# EAGLE design tick-box-1591A-mk-2.0 (EAGLE 6.5.0)
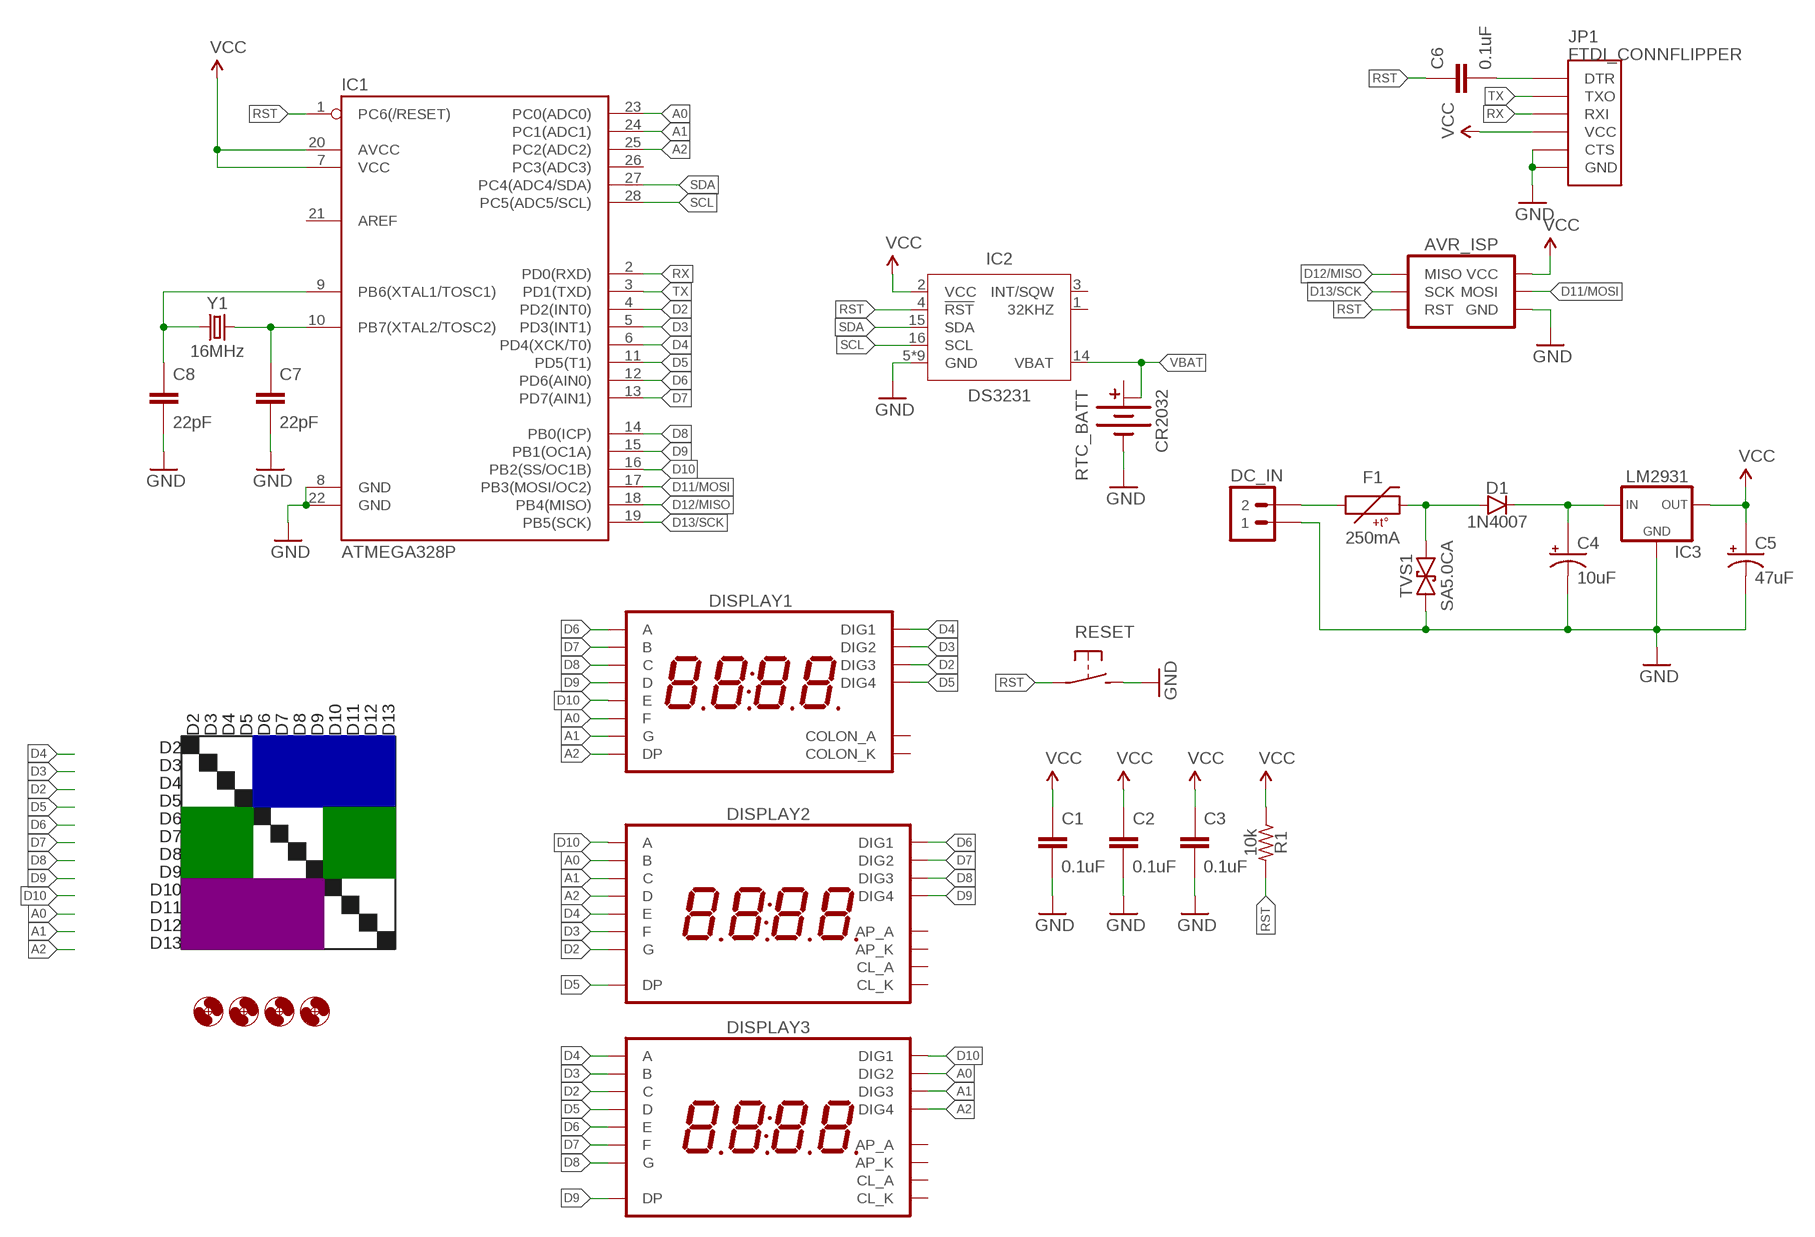
[diagram p0: schematic, sheet 1]

## Parts
AVR_ISP  AVR_SPI_PRG_6PTH  [2X3]
C1  0.1uF  CAPACITOR-CERAMIC025-024X044  [C025-024X044]
C2  0.1uF  CAPACITOR-CERAMIC025-024X044  [C025-024X044]
C3  0.1uF  CAPACITOR-CERAMIC025-024X044  [C025-024X044]
C4  10uF  CAPACITOR-POLARIZEDE2-4  [E2-4]
C5  47uF  CAPACITOR-POLARIZEDE2-4  [E2-4]
C6  0.1uF  CAPACITOR-CERAMIC025-024X044  [C025-024X044]
C7  22pF  CAPACITOR-CERAMIC025-024X044  [C025-024X044]
C8  22pF  CAPACITOR-CERAMIC025-024X044  [C025-024X044]
D1  1N4007  DIODEPTH-10.68MM  [DIODE-10.16MM]
DC_IN  M02PTH  [1X02]
DISPLAY1  7SEG_4DIGIT_COLON14.2MM-CC-NS  [7SEG_4DIG_NS]
DISPLAY2  7SEG_4DIGIT_COLON_APOS  [7SEG_4DIG_10MM]
DISPLAY3  7SEG_4DIGIT_COLON_APOS  [7SEG_4DIG_10MM]
F1  250mA  PTCSMD  [PTC-1206]
H1  HOLE#2  [HOLE-#2]
H2  HOLE#2  [HOLE-#2]
H3  HOLE#2  [HOLE-#2]
H4  HOLE#2  [HOLE-#2]
IC1  ATMEGA328P  ATMEGA328P_PDIP  [DIL28-3]
IC2  DS3231  [SO16W]
IC3  LM2931  V_REG_78XXTO-92-INLINE  [TO-92-AMMO]
JP1  FTDI_CONNFLIPPER  [FTDI_CONN_FLIP]
R1  10k  RESISTORPTH-AXIAL-6.35MM  [RESISTOR-AXIAL-PTH-6.35MM]
RESET  SPST-NO-TACT3MM-PTH-SMALL-PADS  [DTS-3-SMALL-PADS]
RTC_BATT  CR2032  BATTERY-COINCR2032_SMD  [BATTCON_20MM_MINE]
TVS1  SA5.0CA  TVSDO-41-10.16MM  [DO-41-TVS-BI-10.16MM]
Y1  16MHz  CRYSTALHC49UV  [HC49U-V]

## Nets
A0: DISPLAY1.P$12(F) DISPLAY2.16(B) DISPLAY3.2(DIG2) IC1.23(PC0(ADC0))
A1: DISPLAY1.P$5(G) DISPLAY2.13(C) DISPLAY3.6(DIG3) IC1.24(PC1(ADC1))
A2: DISPLAY1.P$3(DP) DISPLAY2.3(D) DISPLAY3.8(DIG4) IC1.25(PC2(ADC2))
D2: DISPLAY1.P$10(DIG3) DISPLAY2.15(G) DISPLAY3.13(C) IC1.4(PD2(INT0))
D3: DISPLAY1.P$11(DIG2) DISPLAY2.11(F) DISPLAY3.16(B) IC1.5(PD3(INT1))
D4: DISPLAY1.P$14(DIG1) DISPLAY2.5(E) DISPLAY3.14(A) IC1.6(PD4(XCK/T0))
D5: DISPLAY1.P$6(DIG4) DISPLAY2.7(DP) DISPLAY3.3(D) IC1.11(PD5(T1))
D6: DISPLAY1.P$13(A) DISPLAY2.1(DIG1) DISPLAY3.5(E) IC1.12(PD6(AIN0))
D7: DISPLAY1.P$9(B) DISPLAY2.2(DIG2) DISPLAY3.11(F) IC1.13(PD7(AIN1))
D8: DISPLAY1.P$4(C) DISPLAY2.6(DIG3) DISPLAY3.15(G) IC1.14(PB0(ICP))
D9: DISPLAY1.P$2(D) DISPLAY2.8(DIG4) DISPLAY3.7(DP) IC1.15(PB1(OC1A))
D10: DISPLAY1.P$1(E) DISPLAY2.14(A) DISPLAY3.1(DIG1) IC1.16(PB2(SS/OC1B))
D11/MOSI: AVR_ISP.4(MOSI) IC1.17(PB3(MOSI/OC2))
D12/MISO: AVR_ISP.1(MISO) IC1.18(PB4(MISO))
D13/SCK: AVR_ISP.3(SCK) IC1.19(PB5(SCK))
GND: AVR_ISP.6(GND) C1.2 C2.2 C3.2 C4.- C5.- C7.2 C8.2 DC_IN.1 IC1.8(GND) IC1.22(GND) IC2.5(GND) IC2.6(GND) IC2.7(GND) IC2.8(GND) IC2.9(GND) IC2.10(GND) IC2.11(GND) IC2.12(GND) IC2.13(GND) IC3.2(GND) JP1.CTS JP1.GND RESET.2 RTC_BATT.BOTTOM(-) TVS1.P$1
N$1: C7.1 IC1.10(PB7(XTAL2/TOSC2)) Y1.1
N$2: C8.1 IC1.9(PB6(XTAL1/TOSC1)) Y1.2
N$3: D1.A F1.2 TVS1.P$2
N$4: DC_IN.2 F1.1
N$5: C4.+ D1.C IC3.1(IN)
N$7: C6.2 JP1.DTR
RST: AVR_ISP.5(RST) C6.1 IC1.1(PC6(/RESET)) IC2.4(!RST) R1.P$2 RESET.1
RX: IC1.2(PD0(RXD)) JP1.RXI
SCL: IC1.28(PC5(ADC5/SCL)) IC2.16(SCL)
SDA: IC1.27(PC4(ADC4/SDA)) IC2.15(SDA)
TX: IC1.3(PD1(TXD)) JP1.TXO
VBAT: IC2.14(VBAT) RTC_BATT.TOP@2(+1)
VCC: AVR_ISP.2(VCC) C1.1 C2.1 C3.1 C5.+ IC1.7(VCC) IC1.20(AVCC) IC2.2(VCC) IC3.3(OUT) JP1.VCC R1.P$1
Unconnected: DISPLAY1.P$7(COLON_K) DISPLAY1.P$8(COLON_A) DISPLAY2.4(CL_A) DISPLAY2.9(AP_K) DISPLAY2.10(AP_A) DISPLAY2.12(CL_K) DISPLAY3.4(CL_A) DISPLAY3.9(AP_K) DISPLAY3.10(AP_A) DISPLAY3.12(CL_K) IC1.21(AREF) IC1.26(PC3(ADC3)) IC2.1(32KHZ) IC2.3(INT/SQW) RTC_BATT.TOP@1(+)

## Notes on the sheet
- D2 | D3 | D4 | D5 | D6 | D7 | D8 | D9 | D10 | D11 | D12 | D13
- D2
- D3
- D4
- D5
- D6
- D7
- D8
- D9
- D10
- D11
- D12
- D13

## Library data of the parts
AVR_ISP = A_butts:AVR_SPI_PRG_6: AVR ISP 6 Pin This is the reduced ISP connector for AVR programming. Common on Arduino. This footprint will take up less PCB space and can be used with a 10-pin to 6-pin adapter such as SKU: BOB-08508 **Special note about "TEST_POINT" package. The stop mask is on the top side, so if you want your programming test points to be on the bottom of your board, make sure to place this package on the bottom side of the board. This also ensure that the orientation to program from the bottom side will be correct.
C1-C3 C6-C8 = A_butts:CAPACITOR-CERAMIC: CAPACITOR, European symbol
C4 C5 = A_butts:CAPACITOR-POLARIZED: POLARIZED CAPACITOR, American symbol
D1 = A_butts:DIODE: Diode These are standard reverse protection diodes and small signal diodes. SMA package can handle up to about 1A. SOD-323 can handle about 200mA. What the SOD-323 package when ordering, there are some mfgs out there that are 5-pin packages.
DC_IN = A_butts:M02: Standard 2-pin 0.1" header. Use with - straight break away headers ( PRT-00116) - right angle break away headers (PRT-00553) - swiss pins (PRT-00743) - machine pins (PRT-00117) - female headers (PRT-00115) Molex polarized connector foot print use with: PRT-08233 with associated crimp pins and housings. 2.54_SCREWTERM for use with PRT-10571. 3.5mm Screw Terminal footprints for PRT-08084 5mm Screw Terminal footprints for use with PRT-08433
DISPLAY1 = A_butts:7SEG_4DIGIT_COLON
DISPLAY2 DISPLAY3 = A_butts:7SEG_4DIGIT_COLON_APOS
F1 = A_butts:PTC: Resettable Fuse PTC Resettable Fuse. Spark Fun Electronics SKU : COM-08357; PROD_ID: RES-11150
H1-H4 = A_butts:HOLE: MOUNTING HOLE with drill center marker
IC1 = A_butts:ATMEGA328P_PDIP: uC used in the Arduino 32kb flash, 1k EEPROM, 2k SRAM This is the through-hole version of this chip.
IC2 = A_butts:DS3231
IC3 = A_butts:V_REG_78XX: Voltage Regulator Standard 7805 5V regulator. IGO (Input Ground Output). Spark Fun Electronics SKU : COM-00107
JP1 = A_butts:FTDI_CONN: Connector which mates to FTDI basic or FTDI cable.
R1 = A_butts:RESISTOR: RESISTOR, American symbol
RESET = A_butts:SPST-NO-TACT
RTC_BATT = A_butts:BATTERY-COIN
TVS1 = A_butts:TVS: Transient voltage suppressor- prevents ESD on inputs. Ignore package description- MBRA140 is NOT this type of part!!!
Y1 = A_butts:CRYSTAL: Various standard crystals. Proven footprints. Spark Fun Electronics SKU : COM-00534

## Board
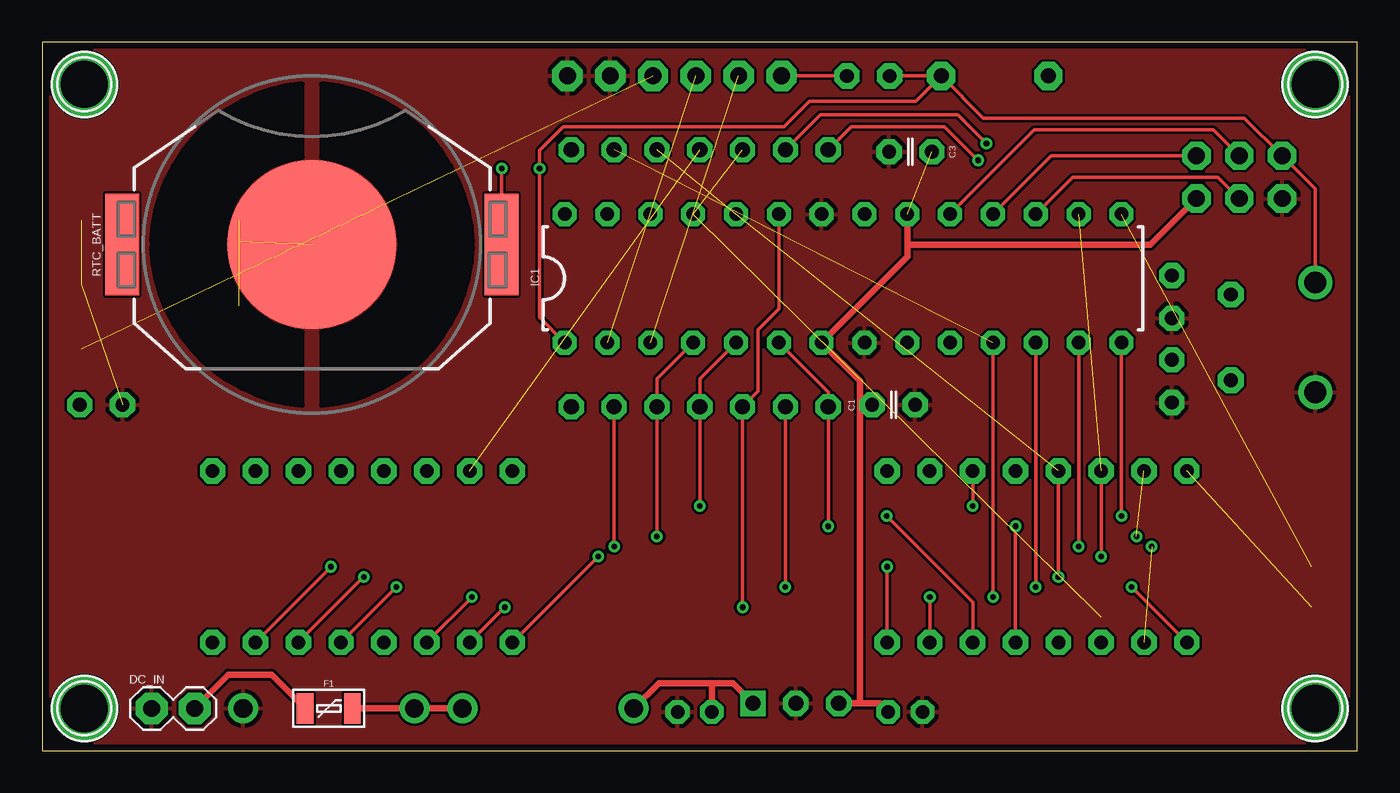
[diagram p1: board, top side]
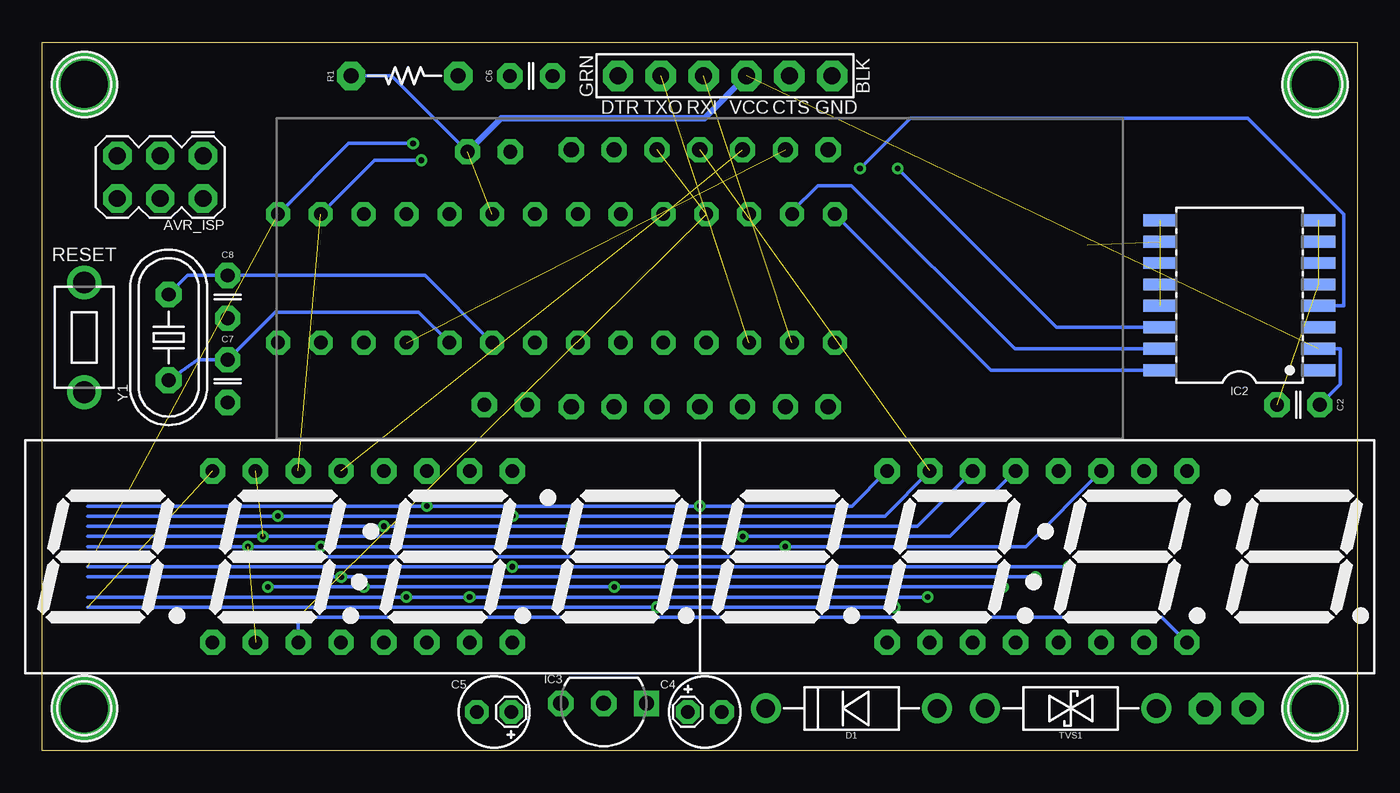
[diagram p2: board, bottom side, seen from below]

Size 78 x 42 mm. Coordinates in mm from the lower left corner, seen from the top.
Outline: 78,42 0,42 0,0 78,0 78,42
Copper layers (1*16): Top 0.0356mm / dielectric 1.5011mm / Bottom 0.0356mm
Design rules "LaenPCBOrder_2": minimum track width 6mil, minimum drill 13mil, track to track 6mil, track to pad 6mil, pad to pad 6mil, via to via 6mil, smd to smd 6mil, copper to edge 15mil, drill to drill 6mil, minimum pad ring 7mil, minimum via ring 7mil, stop-mask expansion 3mil, vias tented up to drill 20mil, thermal gap 10mil

### Footprints (pad centres in the part's own frame; a part is rotated, then mirrored left to right if it is on the bottom)
2X3 = drill 1 pad 1.676 octagon: 1 -2.54,-1.27; 2 -2.54,1.27; 3 0,-1.27; 4 0,1.27; 5 2.54,-1.27; 6 2.54,1.27
C025-024X044 = drill 0.813 pad 1.5 octagon: 1 -1.27,0; 2 1.27,0
E2-4 = drill 0.8 pad 1.4 octagon: + -1.016,0; - 1.016,0
DIODE-10.16MM = drill 1.1 pad 1.778: A -5.08,0; C 5.08,0
1X02 = drill 1 pad 1.88 octagon: 1 0,0; 2 2.54,0
7SEG_4DIG_NS = drill 0.9 pad 1.5 octagon: P$1 -7.62,7.62; P$2 -5.08,7.62; P$3 -2.54,7.62; P$4 0,7.62; P$5 2.54,7.62; P$6 5.08,7.62; P$7 7.62,7.62; P$8 7.62,-7.62; P$9 5.08,-7.62; P$10 2.54,-7.62; P$11 0,-7.62; P$12 -2.54,-7.62; P$13 -5.08,-7.62; P$14 -7.62,-7.62
7SEG_4DIG_10MM = drill 0.8 pad 1.5 octagon: 1 -8.89,-5.08; 2 -6.35,-5.08; 3 -3.81,-5.08; 4 -1.27,-5.08; 5 1.27,-5.08; 6 3.81,-5.08; 7 6.35,-5.08; 8 8.89,-5.08; 9 8.89,5.08; 10 6.35,5.08; 11 3.81,5.08; 12 1.27,5.08; 13 -1.27,5.08; 14 -3.81,5.08; 15 -6.35,5.08; 16 -8.89,5.08
PTC-1206 = smd 1 x 1.8: 1 -1.4,0; 2 1.4,0
HOLE-#2 = drill 2.8 pad 3.81: P$1 0,0
DIL28-3 = drill 0.8 pad 1.422 octagon: 1 -16.51,-3.81; 2 -13.97,-3.81; 3 -11.43,-3.81; 4 -8.89,-3.81; 5 -6.35,-3.81; 6 -3.81,-3.81; 7 -1.27,-3.81; 8 1.27,-3.81; 9 3.81,-3.81; 10 6.35,-3.81; 11 8.89,-3.81; 12 11.43,-3.81; 13 13.97,-3.81; 14 16.51,-3.81; 15 16.51,3.81; 16 13.97,3.81; 17 11.43,3.81; 18 8.89,3.81; 19 6.35,3.81; 20 3.81,3.81; 21 1.27,3.81; 22 -1.27,3.81; 23 -3.81,3.81; 24 -6.35,3.81; 25 -8.89,3.81; 26 -11.43,3.81; 27 -13.97,3.81; 28 -16.51,3.81
SO16W = smd 0.7 x 2: 1 -4.445,-4.685; 2 -3.175,-4.685; 3 -1.905,-4.685; 4 -0.635,-4.685; 5 0.635,-4.685; 6 1.905,-4.685; 7 3.175,-4.685; 8 4.445,-4.685; 9 4.445,4.685; 10 3.175,4.685; 11 1.905,4.685; 12 0.635,4.685; 13 -0.635,4.685; 14 -1.905,4.685; 15 -3.175,4.685; 16 -4.445,4.685
TO-92-AMMO = drill 0.9 pad 1.5 square: 1 -2.54,0 | drill 0.9 pad 1.5 octagon: 2 0,0; 3 2.54,0
FTDI_CONN_FLIP = drill 1 pad 1.8 octagon: CTS 3.81,0; DTR -6.35,0; GND 6.35,0; RXI -1.27,0; TXO -3.81,0; VCC 1.27,0
RESISTOR-AXIAL-PTH-6.35MM = drill 0.9 pad 1.676 octagon: P$1 -3.175,0; P$2 3.175,0
DTS-3-SMALL-PADS = drill 1.3 pad 2: 1 -3.25,0; 2 3.25,0
BATTCON_20MM_MINE = smd 10 x 10: BOTTOM 0,0 | smd 6 x 2: TOP@1 0,11.25; TOP@2 0,-11.25
DO-41-TVS-BI-10.16MM = drill 1.1 pad 1.778: P$1 -5.08,0; P$2 5.08,0
HC49U-V = drill 0.813 pad 1.524 octagon: 1 -2.54,0; 2 2.54,0

### Placement (x,y rotation side)
AVR_ISP  71,34 180 bottom
C1  50.5,20.5 0 top
C2  3.5,20.5 180 bottom
C3  51.5,35.5 180 top
C4  38.7,2.3 0 bottom
C5  51.2,2.3 180 bottom
C6  49,40 0 bottom
C7  67,21.9 270 bottom
C8  67,26.9 270 bottom
D1  30,2.5 180 bottom
DC_IN  6.5,2.5 0 top
DISPLAY1  39,28 0 bottom
DISPLAY2  59,11.5 0 bottom
DISPLAY3  19,11.5 0 bottom
F1  17,2.5 0 top
H1  2.5,2.5 0 top
H2  2.5,39.5 0 top
H3  75.5,2.5 0 top
H4  75.5,39.5 0 top
IC1  47.5,28 0 top
IC2  7,27 90 bottom
IC3  44.7,2.8 180 bottom
JP1  37.5,40 0 bottom
R1  56.5,40 0 bottom
RESET  75.5,24.5 270 bottom
RTC_BATT  16,30 90 top
TVS1  17,2.5 180 bottom
Y1  70.5,24.5 90 bottom

### Tracks (layer width: path | path; a pad name or v marks a point on that pad's centre or on a via)
A0  (via drill 0.33)  (1 unrouted)
  Top 0.2: DISPLAY3.2 v27.43,8.5 | v41.54,8.5 DISPLAY1.P$12 42.45,21.29 42.45,24.95 43.69,26.19 IC1.23
  Bottom 0.2: v27.43,8.5 v41.54,8.5 75.3,8.5
A1  (via drill 0.33)  (2 unrouted)
  Top 0.2: DISPLAY3.6 v19.07,10.3 | v60.27,10.3 DISPLAY2.13
  Bottom 0.2: v19.07,10.3 v60.27,10.3 75.3,10.3
A2  (2 unrouted)
  Bottom 0.2: DISPLAY3.8 11.59,7.9 62.81,7.9 DISPLAY2.3
D2  (via drill 0.33)  (1 unrouted)
  Top 0.2: v36.46,12.7 DISPLAY1.P$10 36.46,22.04 IC1.4
  Bottom 0.2: DISPLAY3.13 24.15,12.7 v36.46,12.7 v64.9,12.7 75.3,12.7
D3  (via drill 0.33)
  Top 0.2: DISPLAY2.11 v55.19,14.5 | v39,14.5 DISPLAY1.P$11 39,22.04 IC1.5
  Bottom 0.2: DISPLAY3.16 29.97,14.5 v39,14.5 v55.19,14.5 75.3,14.5
D4  (via drill 0.33)
  Top 0.2: v57.73,13.3 DISPLAY2.5 | v46.62,13.3 DISPLAY1.P$14 46.62,21.26 IC1.6
  Bottom 0.2: DISPLAY3.14 26.09,13.3 v46.62,13.3 v57.73,13.3 75.3,13.3
D5  (via drill 0.33)  (1 unrouted)
  Top 0.2: DISPLAY3.3 v25.49,9.1 | DISPLAY2.7 v52.65,9.1 | IC1.11 v56.39,9.1
  Bottom 0.2: v25.49,9.1 v52.65,9.1 v56.39,9.1 75.3,9.1
D6  (via drill 0.33)
  Top 0.2: DISPLAY3.5 v21.01,9.7 | DISPLAY1.P$13 v44.08,9.7 | IC1.12 v58.93,9.7 | DISPLAY2.1 v64.61,9.7
  Bottom 0.2: v21.01,9.7 v44.08,9.7 v58.93,9.7 v64.61,9.7
D7  (via drill 0.33)  (1 unrouted)
  Top 0.2: DISPLAY1.P$9 v33.92,12.1 | IC1.13 v61.47,12.1
  Bottom 0.2: DISPLAY3.11 19.67,12.1 v33.92,12.1 v61.47,12.1 v65.8,12.1 75.3,12.1
D8  (via drill 0.33)  (1 unrouted)
  Top 0.2: v50.09,13.9 55.19,8.8 DISPLAY2.6 | IC1.14 v64.01,13.9
  Bottom 0.2: DISPLAY3.15 28.03,13.9 v50.09,13.9 v64.01,13.9 75.3,13.9
D9  (via drill 0.33)  (1 unrouted)
  Top 0.2: DISPLAY3.7 v17.13,10.9 | DISPLAY2.8 v50.11,10.9 | DISPLAY1.P$2 46.16,37.7 54.3,37.7 v56,36
  Bottom 0.2: v17.13,10.9 v50.11,10.9 75.3,10.9 | v56,36 59.82,36 IC1.15
D10  (via drill 0.33)  (1 unrouted)
  Top 0.2: DISPLAY3.1 v32.97,11.5 | v62.81,11.5 DISPLAY2.14 | DISPLAY1.P$1 48,37 53.5,37 v55.5,35
  Bottom 0.2: v32.97,11.5 v62.81,11.5 | v55.5,35 58.28,35 IC1.16
D11/MOSI
  Top 0.2: IC1.17 61.12,34 69.73,34 AVR_ISP.4
D12/MISO
  Top 0.2: AVR_ISP.1 59.85,35.27 IC1.18
D13/SCK
  Top 0.2: IC1.19 58.84,36.8 69.47,36.8 AVR_ISP.3
GND  (9 unrouted)
  pour Top: 0,0 0,42 78,42 78,0
N$1
  Bottom 0.2: Y1.1 68.79,23.17 C7.1 64.17,26 55.66,26 IC1.10
N$2
  Bottom 0.2: IC1.9 55.29,28.17 C8.1 69.37,28.17 Y1.2
N$3
  Top 0.4: F1.2 TVS1.P$2 D1.A
N$4
  Top 0.4: DC_IN.2 11.04,4.5 13.6,4.5 F1.1
N$5
  Top 0.4: D1.C 36.58,4 39.7,4 | 39.7,4 40.96,4 IC3.1 | C4.+ 39.72,3.98 39.7,4
N$7
  Top 0.2: JP1.DTR C6.2
RST  (via drill 0.33)
  Top 0.2: R1.P$2 55.83,37.5 71.31,37.5 AVR_ISP.5 75.5,33.31 RESET.1 | C6.1 R1.P$2 | IC1.1 29.5,25.68 v29.5,34.5 29.5,35.6 30.9,37 44,37 45.5,38.5 51.83,38.5 R1.P$2
  Bottom 0.2: IC2.4 0.8,26.36 0.8,31.8 6.5,37.5 26.5,37.5 v29.5,34.5
RX  (1 unrouted)
SCL
  Bottom 0.2: IC2.16 21.73,22.55 IC1.28
SDA
  Bottom 0.2: IC2.15 20.32,23.82 30,33.5 32,33.5 33.53,31.97 IC1.27
TX  (1 unrouted)
VBAT  (via drill 0.33)
  Top 0.2: RTC_BATT.TOP@2 v27.25,34.5
  Bottom 0.2: v27.25,34.5 17.84,25.09 IC2.14
VCC  (2 unrouted)
  Top 0.4: 48.5,20.4 48.5,2.9 48.4,2.8 | 48.5,20.4 48.5,21.92 IC1.7 51.31,29.27 51.31,30 | C1.1 48.6,20.5 48.5,20.4 | IC3.3 48.4,2.8 | 48.4,2.8 49.68,2.8 C5.+ | 51.31,30 IC1.20 | AVR_ISP.2 65.73,30 51.31,30
  Bottom 0.2: R1.P$1 57.27,40 C3.1 | IC2.2 1,23.82 1,21.73 C2.1
  Bottom 0.4: JP1.VCC 38.73,37.5 50.77,37.5 C3.1